# Altium schematic sheet AUDIO_2.SchDoc: Air724UG 参考设计
size 594 x 419 mm; DESIGNER: Loukanghua; REV: V1.0
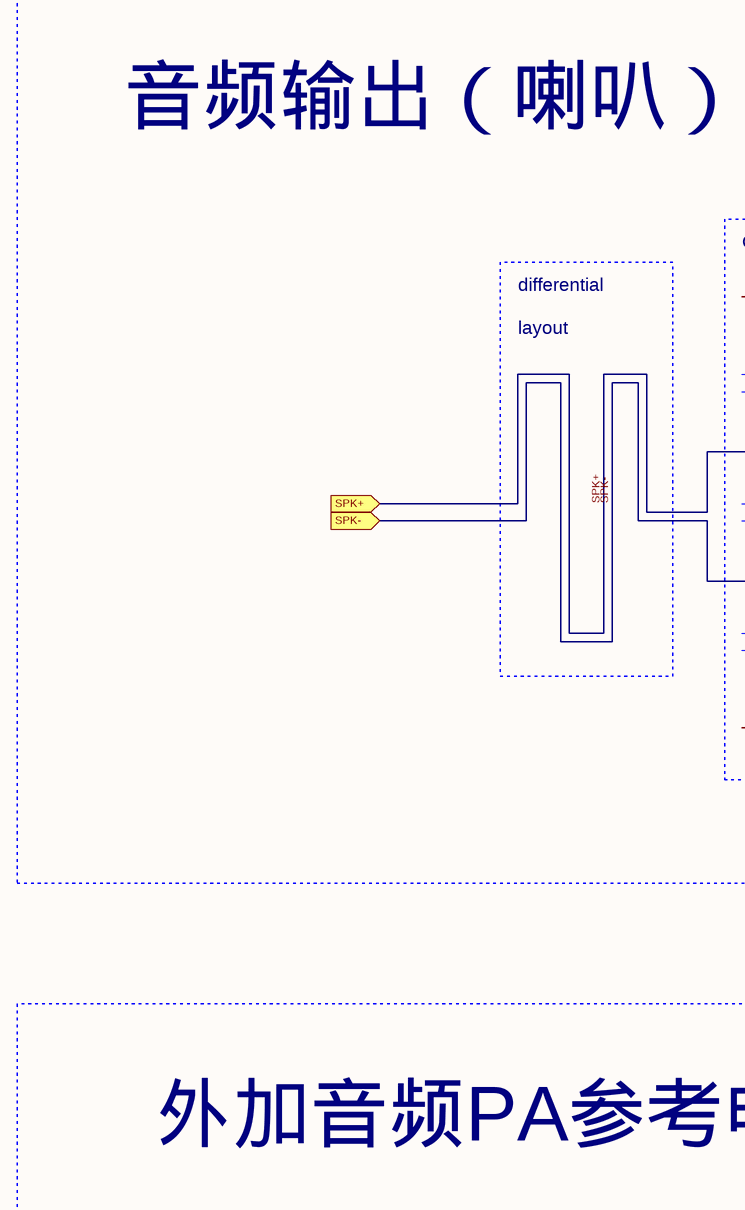
[diagram p0: AUDIO_2.SchDoc, top left]
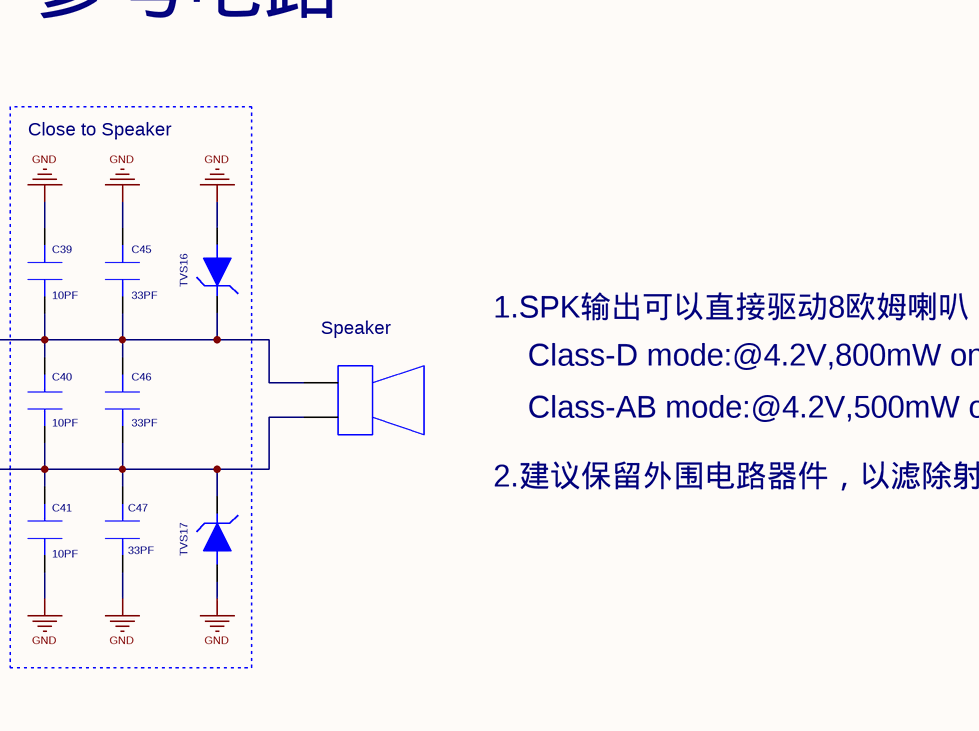
[diagram p1: AUDIO_2.SchDoc, top middle]
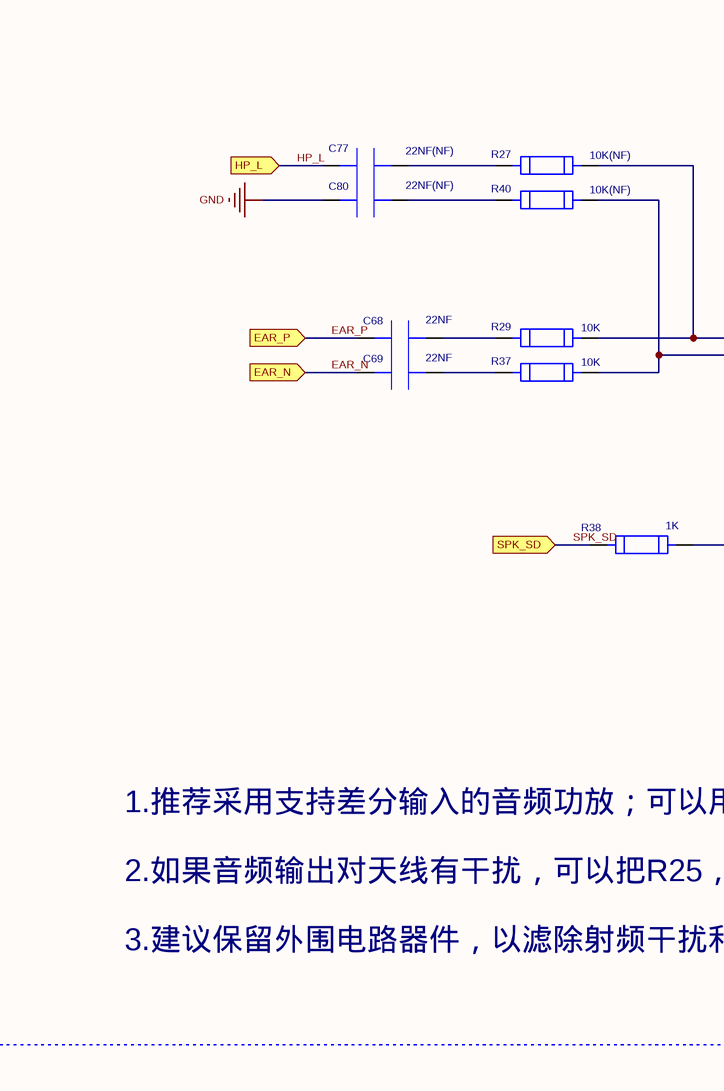
[diagram p2: AUDIO_2.SchDoc, bottom left]
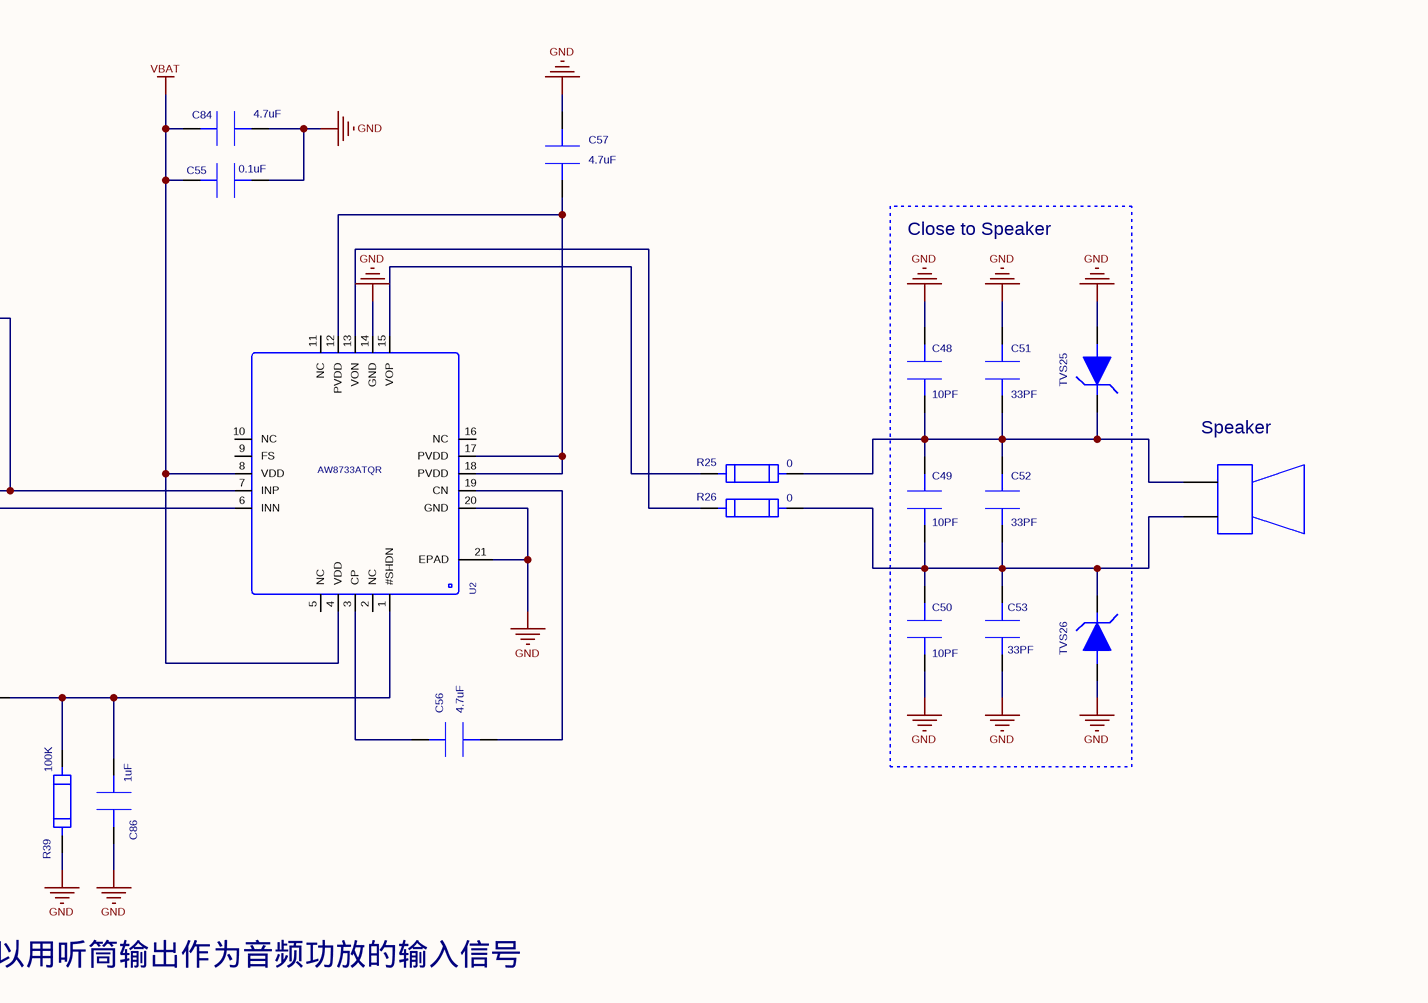
[diagram p3: AUDIO_2.SchDoc, bottom middle]
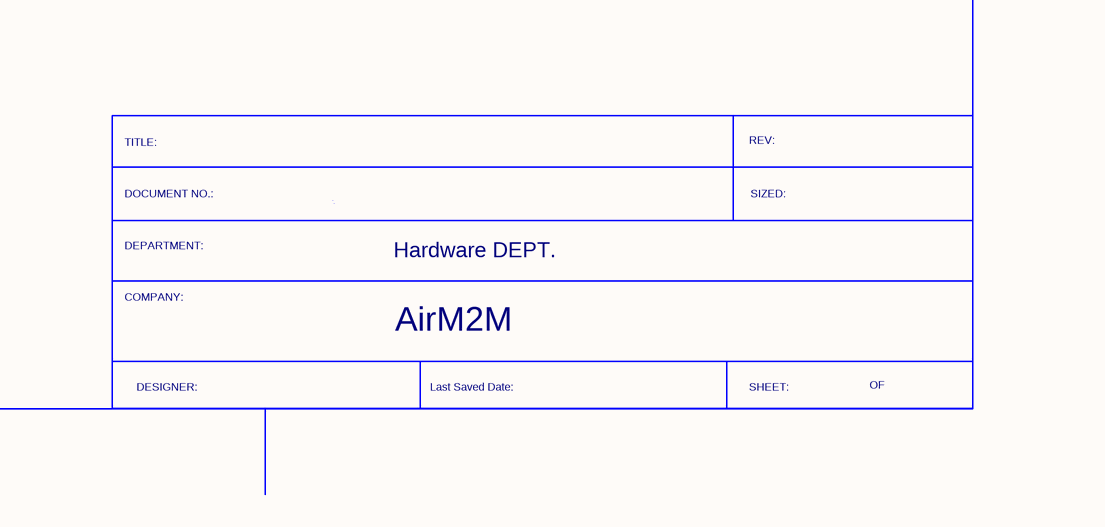
[diagram p4: AUDIO_2.SchDoc, bottom right]

## Parts
C39  value 10PF  [SC0201]  (hidden comment: CAP-10PF-0201-COG)
C40  value 10PF  [SC0201]  (hidden comment: CAP-10PF-0201-COG)
C41  value 10PF  [SC0201]  (hidden comment: CAP-10PF-0201-COG)
C45  value 33PF  [SC0201]  (hidden comment: CAP-10PF-0201-COG)
C46  value 33PF  [SC0201]  (hidden comment: CAP-10PF-0201-COG)
C47  value 33PF  [SC0201]  (hidden comment: CAP-10PF-0201-COG)
C48  value 10PF  [SC0201]  (hidden comment: CAP-10PF-0201-COG)
C49  value 10PF  [SC0201]  (hidden comment: CAP-10PF-0201-COG)
C50  value 10PF  [SC0201]  (hidden comment: CAP-10PF-0201-COG)
C51  value 33PF  [SC0201]  (hidden comment: CAP-10PF-0201-COG)
C52  value 33PF  [SC0201]  (hidden comment: CAP-10PF-0201-COG)
C53  value 33PF  [SC0201]  (hidden comment: CAP-10PF-0201-COG)
C55  value 0.1uF  [SC0402]  (hidden comment: CAP-0.1UF-0402-X5R-10V)
C56  value 4.7uF  [SC0603]  (hidden comment: CAP-4.7UF-0603-Y5V-10V)
C57  value 4.7uF  [SC0603]  (hidden comment: CAP-4.7UF-0603-Y5V-10V)
C68  value 22NF  [SC0402]  (hidden comment: CAP-22NF-0402-X7R)
C69  value 22NF  [SC0402]  (hidden comment: CAP-22NF-0402-X7R)
C77  value 22NF(NF)  [SC0402]  (hidden comment: CAP-22NF-0402-X7R)
C80  value 22NF(NF)  [SC0402]  (hidden comment: CAP-22NF-0402-X7R)
C84  value 4.7uF  [SC0603]  (hidden comment: CAP-4.7UF-0603-Y5V-10V)
C86  value 1uF  [SC0402]  (hidden comment: CAP-1UF-0402-X5R)
J8  AUDIO-SPEAKER-BLUEHY  [CON2-2]  (value not drawn)
J9  AUDIO-SPEAKER-BLUEHY  [CON2-2]  (value not drawn)
R25  value 0  [SR0402]  (hidden comment: RES-0-0402)
R26  value 0  [SR0402]  (hidden comment: RES-0-0402)
R27  value 10K(NF)  [SR0402]  (hidden comment: RES-10K-+-1%-0402)
R29  value 10K  [SR0402]  (hidden comment: RES-10K-+-1%-0402)
R37  value 10K  [SR0402]  (hidden comment: RES-10K-+-1%-0402)
R38  value 1K  [SR0402]  (hidden comment: RES-1K-0402)
R39  value 100K  [SR0402]  (hidden comment: RES-100K-0402)
R40  value 10K(NF)  [SR0402]  (hidden comment: RES-10K-+-1%-0402)
TVS16  ESD-TVS-ESD9X5.0ST5G  [SOD-923-ESD9X5.0ST5G]  (value not drawn)
TVS17  ESD-TVS-ESD9X5.0ST5G  [SOD-923-ESD9X5.0ST5G]  (value not drawn)
TVS25  ESD-TVS-ESD9X5.0ST5G  [SOD-923-ESD9X5.0ST5G]  (value not drawn)
TVS26  ESD-TVS-ESD9X5.0ST5G  [SOD-923-ESD9X5.0ST5G]  (value not drawn)
U2  AW8733ATQR  [TQFN-20L_L3.0-W3.0-P0.40-BL-EP]  (value not drawn)

## Blocks framed on the sheet
音频输出（喇叭）参考电路: J8
Close to Speaker: C39-C41 C45-C47 TVS16 TVS17
外加音频PA参考电路: C55-C57 C68 C69 C77 C80 C84 C86 J9 R25-R27 R29 R37-R40 U2
Close to Speaker: C48-C53 TVS25 TVS26

## Ports
EAR_N, EAR_P, HP_L, SPK+, SPK-, SPK_SD

## Nets
GND: C39.1 C41.2 C45.1 C47.2 C48.1 C50.2 C51.1 C53.2 C55.1 C57.1 C80.1 C84.2 C86.1 R39.1 TVS16.2 TVS17.2 TVS25.2 TVS26.2 U2.14(GND) U2.20(GND) U2.21(EPAD)
VBAT: C55.2 C84.1 U2.4(VDD) U2.8(VDD)
EAR_N: C69.1 ; port EAR_N
EAR_P: C68.1 ; port EAR_P
HP_L: C77.1 ; port HP_L
SPK+: C39.2 C40.1 C45.2 C46.1 J8.1 TVS16.1 ; port SPK+
SPK-: C40.2 C41.1 C46.2 C47.1 J8.2 TVS17.1 ; port SPK-
SPK_SD: R38.1 ; port SPK_SD
NetC48_2: C48.2 C49.1 C51.2 C52.1 J9.1 R25.2 TVS25.1
NetC49_2: C49.2 C50.1 C52.2 C53.1 J9.2 R26.2 TVS26.1
NetC56_1: C56.1 U2.3(CP)
NetC56_2: C56.2 U2.19(CN)
NetC57_2: C57.2 U2.12(PVDD) U2.17(PVDD) U2.18(PVDD)
NetC68_2: C68.2 R29.1
NetC69_2: C69.2 R37.1
NetC77_2: C77.2 R27.1
NetC80_2: C80.2 R40.1
NetC86_2: C86.2 R38.2 R39.2 U2.1(#SHDN)
NetR25_1: R25.1 U2.15(VOP)
NetR26_1: R26.1 U2.13(VON)
NetR27_2: R27.2 R29.2 U2.7(INP)
NetR37_2: R37.2 R40.2 U2.6(INN)

Not connected (* = marked no-connect by the designer): U2 2(NC) 5(NC) 9(FS) 10(NC) 11(NC) 16(NC)

## Notes on the sheet
- differential
- layout
- (near J8) Speaker
- 1.SPK输出可以直接驱动8欧姆喇叭，可以根据需要配置Class-D 或者 Class-AB 模式
- Class-D mode:@4.2V,800mW on 8Ohm load
- Class-AB mode:@4.2V,500mW on 8Ohm load
- 2.建议保留外围电路器件，以滤除射频干扰和增强ESD防护性能。
- (near J9) Speaker
- 1.推荐采用支持差分输入的音频功放；可以用听筒输出作为音频功放的输入信号
- 2.如果音频输出对天线有干扰，可以把R25，R26换成磁珠
- 3.建议保留外围电路器件，以滤除射频干扰和增强ESD防护性能。
- TITLE:
- REV:
- DEPARTMENT:
- DOCUMENT NO.:
- Hardware DEPT.
- SIZED:
- COMPANY:
- AirM2M
- DESIGNER:
- Last Saved Date:
- SHEET:
- OF

## Library data of the parts
C39-C41 C45-C53 = CAP-10PF-0201-COG: CAP CER C0G;10PF;+/-5%;25V;0201;0.35mm;ROHS; Manufacture 1: Eyang;; Manufacture 1 P/N: C0201C0G100J250NT; Serial Number: 80212640006; Geometry.Height: 0.35mm; Tolerance: +/-5%; PCB DECAL: SC0201
C55 = CAP-0.1UF-0402-X5R-10V: CAP CER X5R/X7R;0.1uF;+/-10%;10V;0402;0.5mm;ROHS; Manufacture 1: Murata;Yageo;Walsin;Eyang; Manufacture 1 P/N: GRM155R61A104K****;GRM155R71A104K****;CC0402KRX5R6BB104;0402X104K100CT;C0402X5R104K100N*; Geometry.Height: 0.55mm; Serial Number: 80214720001; Tolerance: +/-10%; PCB DECAL: SC0402
C56 C57 C84 = CAP-4.7UF-0603-Y5V-10V: CAP CER Y5V;4.7uF;+80% -20%;10V;0603;0.8mm;ROHS; Manufacture 1: Murata;TDK;Taiyo Yuden;; Manufacture 1 P/N: GRM188F51A475Z****;C1608Y5V0J475Z;JMK107BJ475MA-T;; Geometry.Height: 0.95mm; Serial Number: 80216920001; Tolerance: +/-10%; PCB DECAL: SC0603
C68 C69 C77 C80 = CAP-22NF-0402-X7R: CAP CER X7R;22NF;+/-10%;50V;0402;0.5mm;ROHS; Manufacture 1: MURATA;Yageo;220PF; Manufacture 1 P/N: GRM155R71H221K****;CC0402KRX7R9BB221;C0402X7R221K500N*; Geometry.Height: 0.55mm; Serial Number: 80214750003; Tolerance: +/-10%; PCB DECAL: SC0402
C86 = CAP-1UF-0402-X5R: CAP CER X5R;1uF;+/-10%;6.3V;0402;0.5mm;ROHS; Manufacture 1 P/N: GRM155R60J105K****;CC0402KRX5R5BB105;C1005X5R0J105KT;JMK105BJ105KV-F;ECJ0EB0J105K;0402X105K6R3CT;CL05A105KQ5NNNC; Manufacture 1: Murata;Yageo;TDK;Taiyo Yuden;Panasonic;Walsin;Samsung; Serial Number: 80214710001; Geometry.Height: 0.55mm; Tolerance: +/-10%; PCB DECAL: SC0402
R25 R26 = RES-0-0402: RES FILM;0;1A;0402;0.4mm;ROHS; Manufacture 1: YAGEO; Manufacture 1 P/N: RC0402JR-070RL; Serial Number: 80114640001; Geometry.Height: 0.4mm; PCB DECAL: SR0402
R27 R29 R37 R40 = RES-10K-+-1%-0402: RES FILM;10K;+/-1%;1/16W;0402;0.4mm;ROHS; Manufacture 1 P/N: RC0402FR-0710KL; Manufacture 1: YAGEO; Serial Number: 80114440009; Geometry.Height: 0.4mm; Tolerance: +/-1%; PCB DECAL: SR0402
R38 = RES-1K-0402: RES FILM;1K;+/-5%;1/16W;0402;0.4mm;ROHS; Manufacture 1: YAGEO;Walsin; Manufacture 1 P/N: RC0402JR-071KL;WR04X102_JTL; Geometry.Height: 0.40mm; Serial Number: 80114640003; Tolerance: +/-5%; PCB DECAL: SR0402
R39 = RES-100K-0402: RES FILM;100K;+/-5%;1/16W;0402;0.4mm;ROHS; Manufacture 1: YAGEO;Walsin; Manufacture 1 P/N: RC0402JR-07100KL;WR04X104_JTL;; Geometry.Height: 0.40mm; Serial Number: 80114640005; Tolerance: +/-5%; PCB DECAL: SR0402
TVS16 TVS17 TVS25 TVS26 = ESD-TVS-ESD9X5.0ST5G: TVS;5.0V;65PF;SOD?923;ROHS; Manufacture 1: ONSEMI; Geometry.Height: 0.43mm; Serial Number: 81121000001; Manufacture 1 P/N: ESD9X5.0ST5G; PCB DECAL: SOD-923-ESD9X5.0ST5G
U2 = AW8733ATQR: BOM_Manufacturer: Shanghai Awinic Tech; Contributor: LCSC; spiceSymbolName: AW8733ATQR; spicePre: U; BOM_Manufacturer_Part: AW8733ATQR; BOM_Supplier_Part: C139593; BOM_Supplier: LCSC; PCB DECAL: TQFN-20L_L3.0-W3.0-P0.40-BL-EP
J8 J9 = AUDIO-SPEAKER-BLUEHY: PCB DECAL: CON2-2